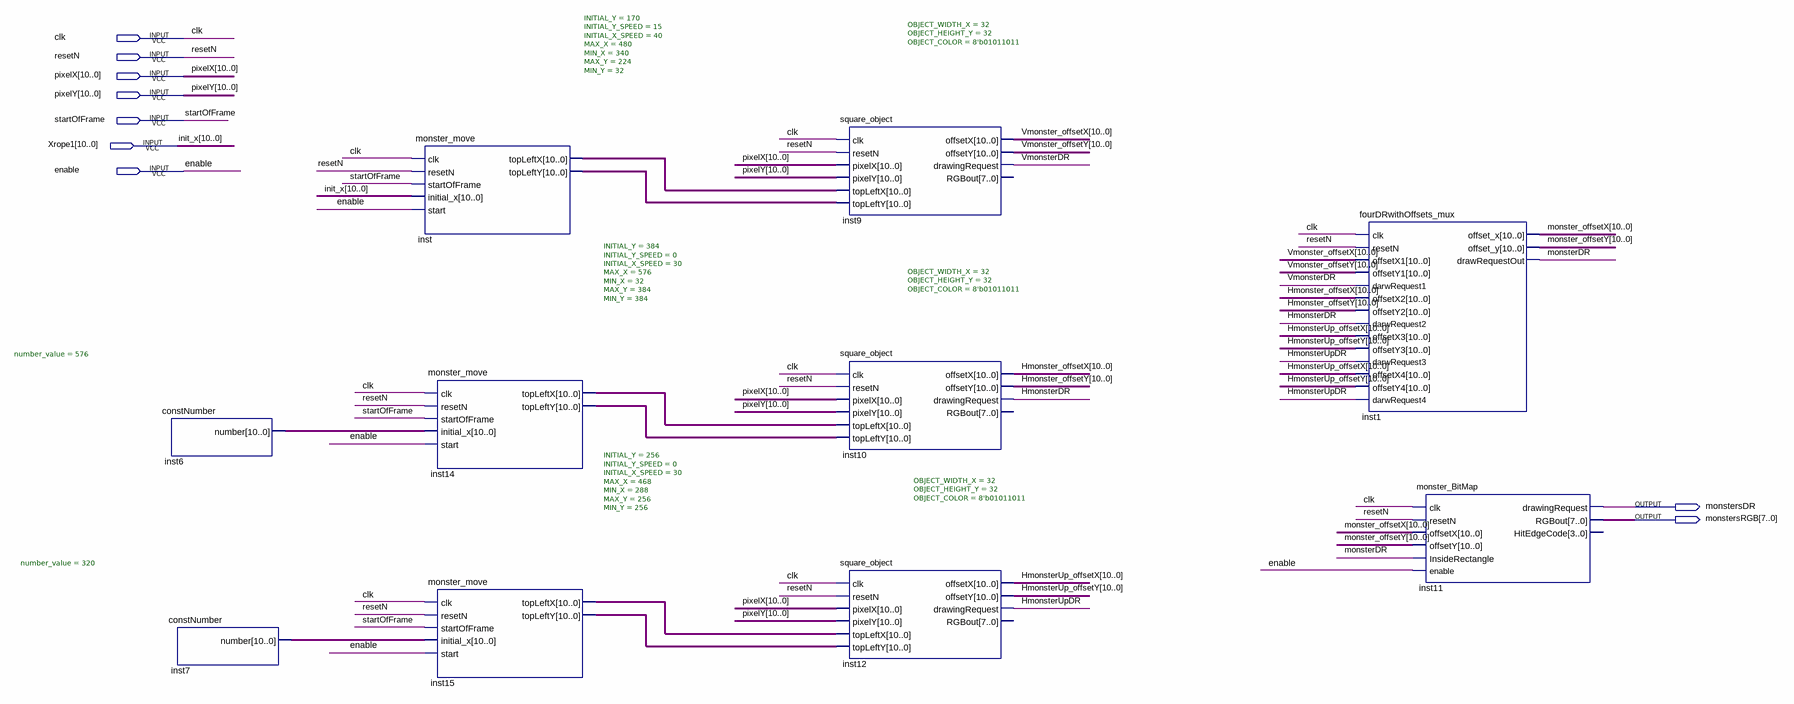
[diagram p0: schematic sheet]
// Quartus schematic monstersBlock.bdf as structural Verilog: 10 symbols, 9 pins
module monstersBlock (
  input  clk,
  input  resetN,
  input  [10:0] pixelX,
  input  [10:0] pixelY,
  input  startOfFrame,
  input  [10:0] Xrope1,
  input  enable,
  output monstersDR,
  output [7:0] monstersRGB
);

  wire HmonsterDR, HmonsterUpDR, monsterDR, VmonsterDR;
  wire [10:0] Hmonster_offsetX, Hmonster_offsetY, HmonsterUp_offsetX, HmonsterUp_offsetY, inst6_number,
       inst7_number, inst14_topleftx, inst14_toplefty, inst15_topleftx, inst15_toplefty, inst_topleftx,
       inst_toplefty, monster_offsetX, monster_offsetY, Vmonster_offsetX, Vmonster_offsetY;

  constNumber #(.number_value(576)) inst6 (.number(inst6_number));
  constNumber #(.number_value(320)) inst7 (.number(inst7_number));
  monster_move #(.INITIAL_Y(170), .INITIAL_Y_SPEED(15), .INITIAL_X_SPEED(40), .MAX_X(480), .MIN_X(340), .MAX_Y(224), .MIN_Y(32)) inst (
    .clk(clk), .resetN(resetN), .startOfFrame(startOfFrame), .initial_x(Xrope1), .start(enable),
    .topLeftX(inst_topleftx), .topLeftY(inst_toplefty));
  monster_move #(.INITIAL_Y(384), .INITIAL_Y_SPEED(0), .INITIAL_X_SPEED(30), .MAX_X(576), .MIN_X(32), .MAX_Y(384), .MIN_Y(384)) inst14 (
    .clk(clk), .resetN(resetN), .startOfFrame(startOfFrame), .initial_x(inst6_number), .start(enable),
    .topLeftX(inst14_topleftx), .topLeftY(inst14_toplefty));
  monster_move #(.INITIAL_Y(256), .INITIAL_Y_SPEED(0), .INITIAL_X_SPEED(30), .MAX_X(468), .MIN_X(288), .MAX_Y(256), .MIN_Y(256)) inst15 (
    .clk(clk), .resetN(resetN), .startOfFrame(startOfFrame), .initial_x(inst7_number), .start(enable),
    .topLeftX(inst15_topleftx), .topLeftY(inst15_toplefty));
  square_object #(.OBJECT_WIDTH_X(32), .OBJECT_HEIGHT_Y(32), .OBJECT_COLOR(8'b01011011)) inst9 (
    .clk(clk), .resetN(resetN), .pixelX(pixelX), .pixelY(pixelY), .topLeftX(inst_topleftx),
    .topLeftY(inst_toplefty), .offsetX(Vmonster_offsetX), .offsetY(Vmonster_offsetY),
    .drawingRequest(VmonsterDR));  // open: RGBout
  square_object #(.OBJECT_WIDTH_X(32), .OBJECT_HEIGHT_Y(32), .OBJECT_COLOR(8'b01011011)) inst10 (
    .clk(clk), .resetN(resetN), .pixelX(pixelX), .pixelY(pixelY), .topLeftX(inst14_topleftx),
    .topLeftY(inst14_toplefty), .offsetX(Hmonster_offsetX), .offsetY(Hmonster_offsetY),
    .drawingRequest(HmonsterDR));  // open: RGBout
  square_object #(.OBJECT_WIDTH_X(32), .OBJECT_HEIGHT_Y(32), .OBJECT_COLOR(8'b01011011)) inst12 (
    .clk(clk), .resetN(resetN), .pixelX(pixelX), .pixelY(pixelY), .topLeftX(inst15_topleftx),
    .topLeftY(inst15_toplefty), .offsetX(HmonsterUp_offsetX), .offsetY(HmonsterUp_offsetY),
    .drawingRequest(HmonsterUpDR));  // open: RGBout
  fourDRwithOffsets_mux inst1 (
    .clk(clk), .resetN(resetN), .offsetX1(Vmonster_offsetX), .offsetY1(Vmonster_offsetY),
    .darwRequest1(VmonsterDR), .offsetX2(Hmonster_offsetX), .offsetY2(Hmonster_offsetY),
    .darwRequest2(HmonsterDR), .offsetX3(HmonsterUp_offsetX), .offsetY3(HmonsterUp_offsetY),
    .darwRequest3(HmonsterUpDR), .offsetX4(HmonsterUp_offsetX), .offsetY4(HmonsterUp_offsetY),
    .darwRequest4(HmonsterUpDR), .offset_x(monster_offsetX), .offset_y(monster_offsetY),
    .drawRequestOut(monsterDR));
  monster_BitMap inst11 (
    .clk(clk), .resetN(resetN), .offsetX(monster_offsetX), .offsetY(monster_offsetY),
    .InsideRectangle(monsterDR), .enable(enable), .drawingRequest(monstersDR), .RGBout(monstersRGB));  // open: HitEdgeCode

  // Other names for the same wires on the sheet: init_x[10:0] = Xrope1
endmodule
